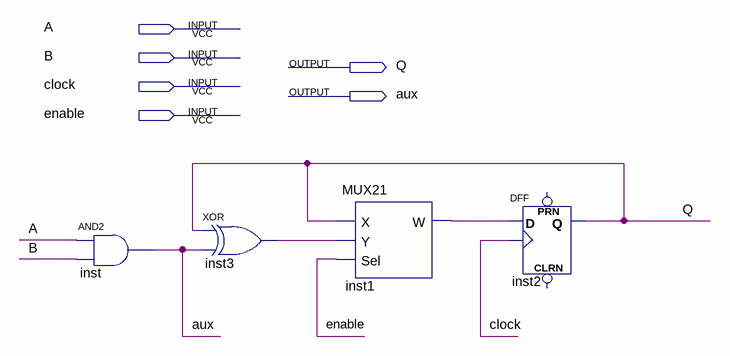
[diagram p0: schematic sheet]
// Quartus schematic AuxSomador.bdf as structural Verilog: 4 symbols, 6 pins
module AuxSomador (
  input  A,
  input  B,
  input  clock,
  input  enable,
  output Q,
  output aux
);

  wire inst1_w, inst3_out;

  and inst (aux, A, B);
  xor inst3 (inst3_out, Q, aux);
  MUX21 inst1 (.X(Q), .Y(inst3_out), .Sel(enable), .W(inst1_w));
  DFF inst2 (.CLK(clock), .D(inst1_w), .Q(Q));  // open: CLRN, PRN
endmodule
